# EAGLE design stimulation (EAGLE 7.1.0)
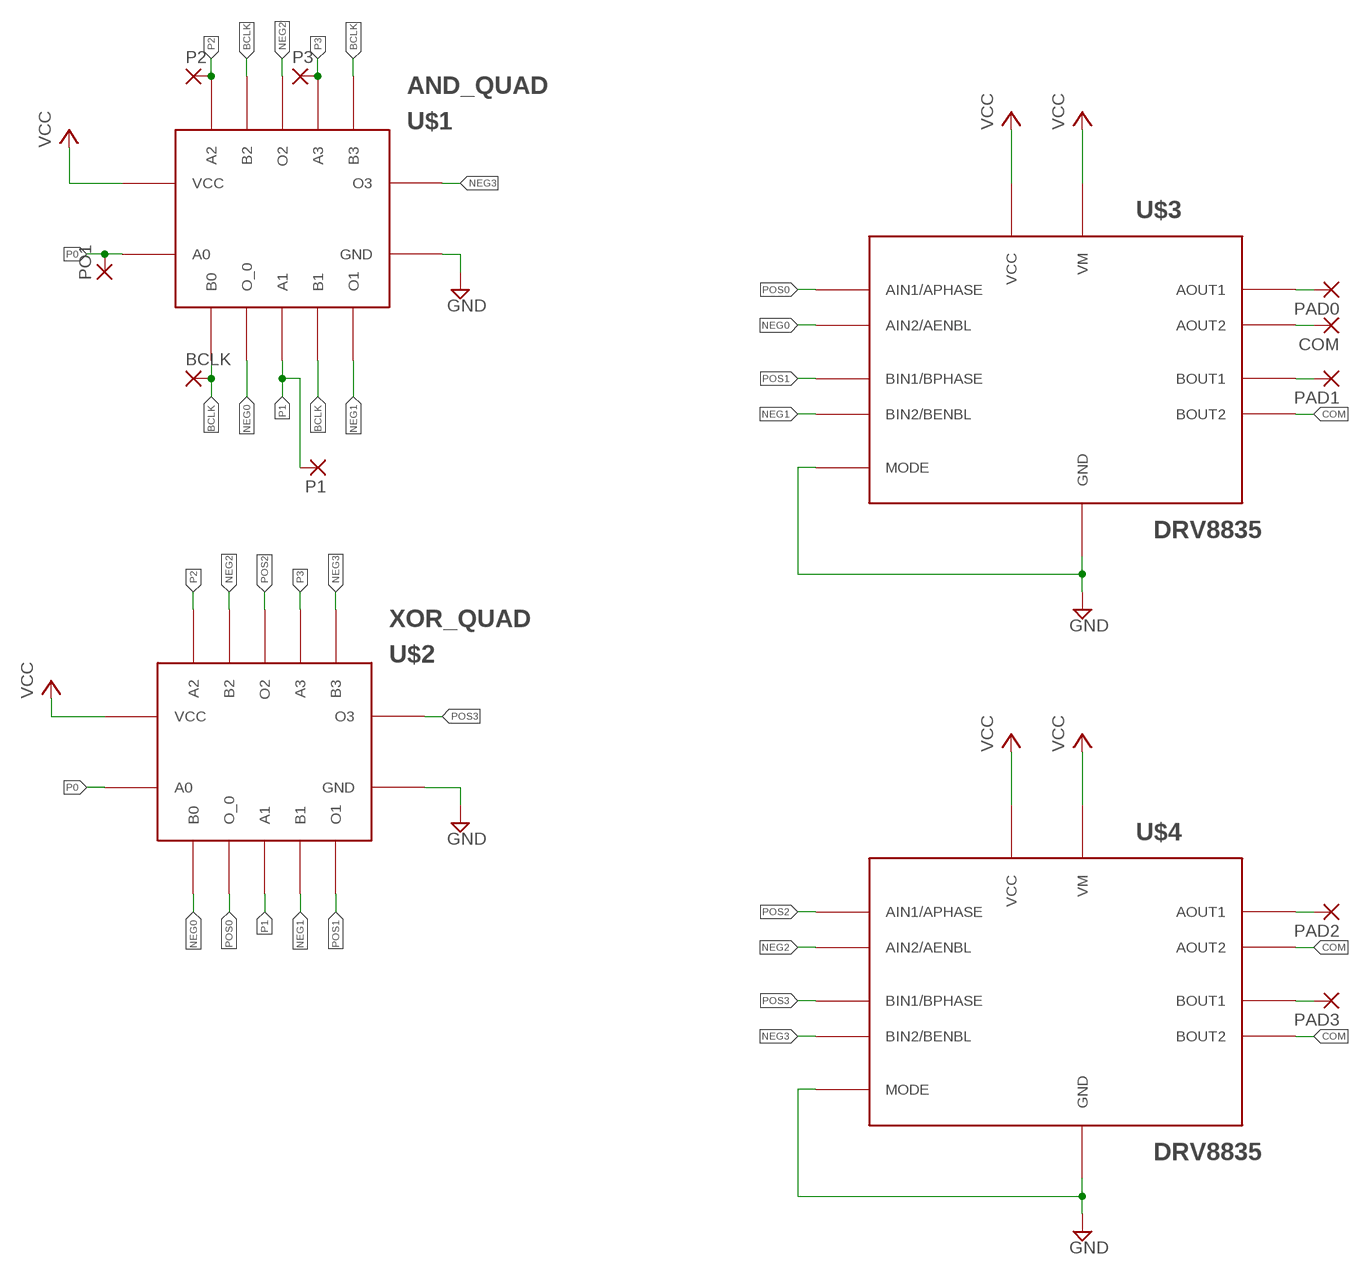
[diagram p0: schematic, sheet 1]

## Parts
BCLK  SMD2  [SMD1,27-2,54]
COM  SMD2  [SMD1,27-2,54]
P1  SMD2  [SMD1,27-2,54]
P2  SMD2  [SMD1,27-2,54]
P3  SMD2  [SMD1,27-2,54]
PAD0  SMD2  [SMD1,27-2,54]
PAD1  SMD2  [SMD1,27-2,54]
PAD2  SMD2  [SMD1,27-2,54]
PAD3  SMD2  [SMD1,27-2,54]
PO1  SMD2  [SMD1,27-2,54]
U$1  AND_QUAD  [QFN-14]
U$2  XOR_QUAD  [QFN-14]
U$3  DRV8835  [QFN-12-HEATSINK]
U$4  DRV8835  [QFN-12-HEATSINK]

## Nets
BCLK: BCLK.1(P) U$1.B0 U$1.B1 U$1.B2 U$1.B3
COM: COM.1(P) U$3.AOUT2 U$3.BOUT2 U$4.AOUT2 U$4.BOUT2
GND: U$1.GND U$2.GND U$3.GND U$3.MODE U$4.GND U$4.MODE
N$5: P1.1(P) U$1.A1
N$6: PAD0.1(P) U$3.AOUT1
N$8: P2.1(P) U$1.A2
N$9: PAD1.1(P) U$3.BOUT1
N$11: P3.1(P) U$1.A3
N$14: PO1.1(P) U$1.A0
N$17: PAD2.1(P) U$4.AOUT1
N$19: PAD3.1(P) U$4.BOUT1
NEG0: U$1.O_0 U$2.B0 U$3.AIN2.AENBL(AIN2/AENBL)
NEG1: U$1.O1 U$2.B1 U$3.BIN2/BENBL
NEG2: U$1.O2 U$2.B2 U$4.AIN2.AENBL(AIN2/AENBL)
NEG3: U$1.O3 U$2.B3 U$4.BIN2/BENBL
P0: U$2.A0
P1: U$2.A1
P2: U$2.A2
P3: U$2.A3
POS0: U$2.O_0 U$3.AIN1/APHASE
POS1: U$2.O1 U$3.BIN1/BPHASE
POS2: U$2.O2 U$4.AIN1/APHASE
POS3: U$2.O3 U$4.BIN1/BPHASE
VCC: U$1.VCC U$2.VCC U$3.VCC U$3.VM U$4.VCC U$4.VM

## Library data of the parts
BCLK COM P1-P3 PAD0 PAD1-PAD3 PO1 = wirepad:SMD2: SMD PAD
U$1 = kushal:AND_QUAD: Quad package SMD AND chip
U$2 = kushal:XOR_QUAD: Quad package SMD XOR
U$3 U$4 = kushal:DRV8835: DRV8835 dual package motor driver H bridge

## Board
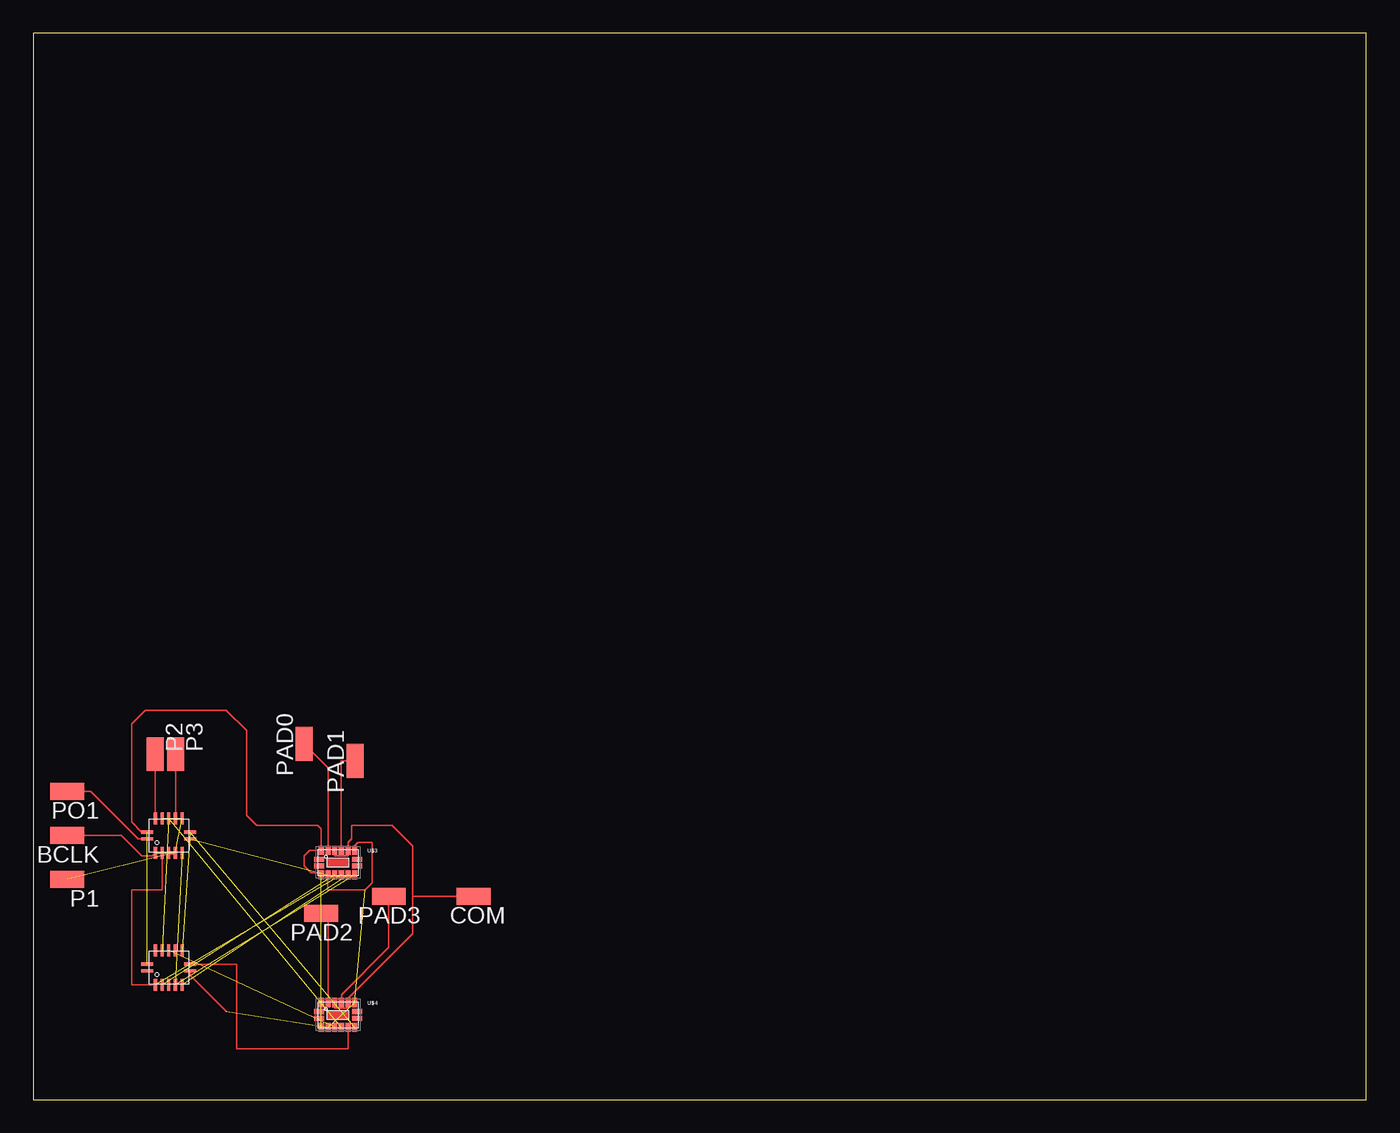
[diagram p1: board, top side]
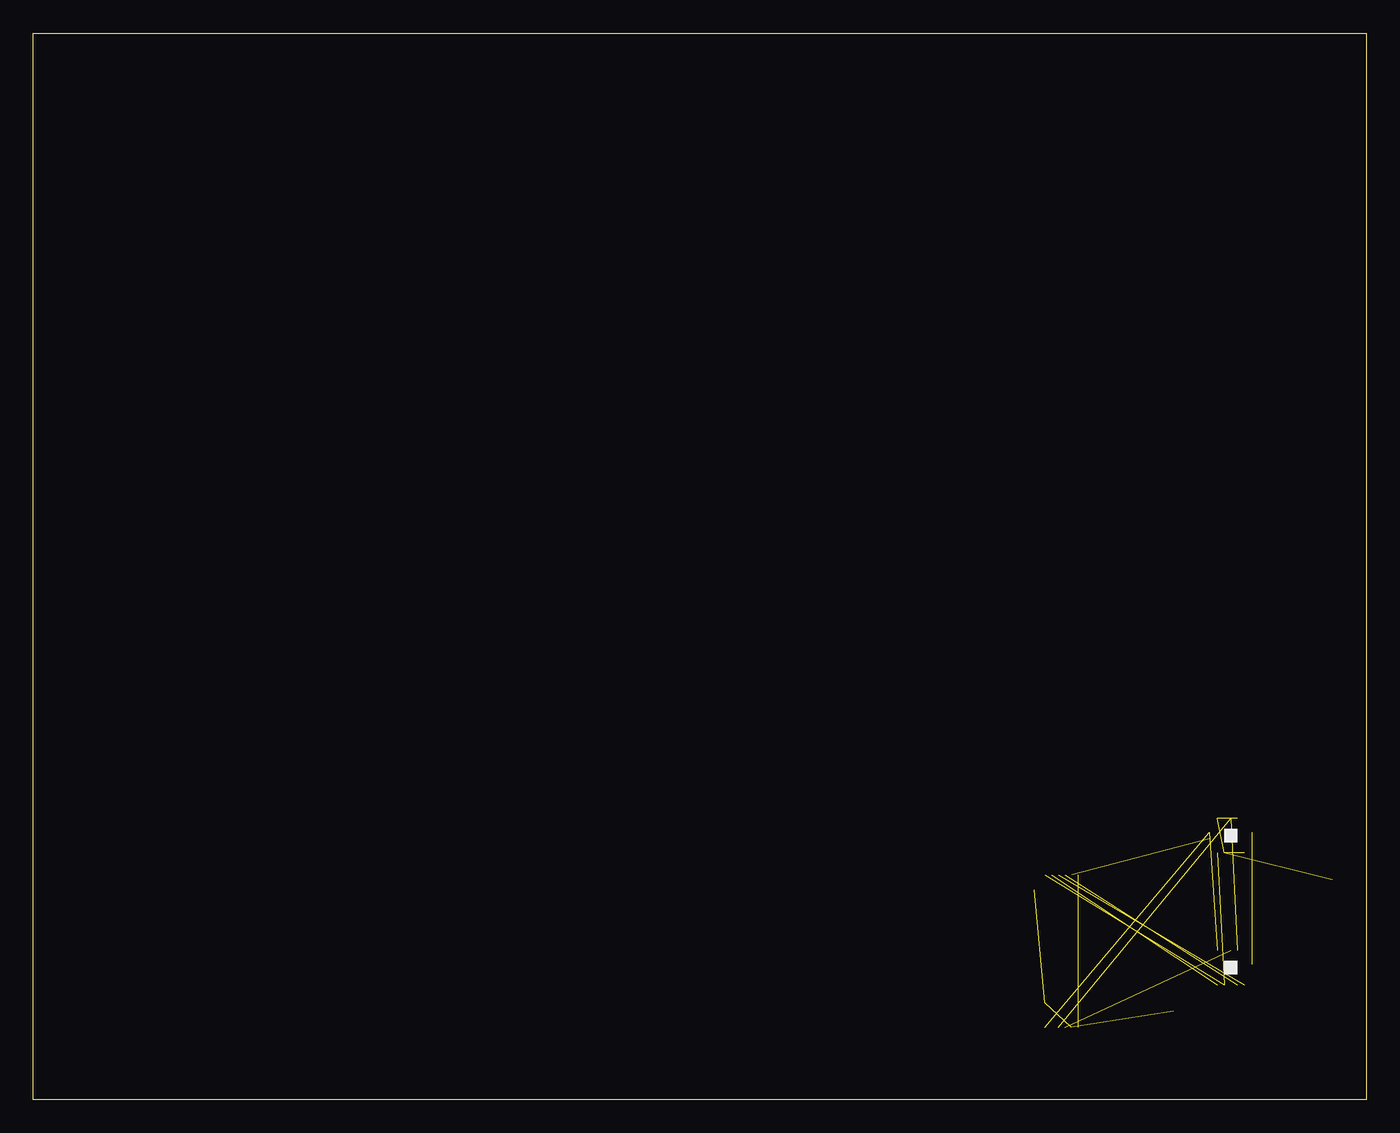
[diagram p2: board, bottom side, seen from below]

Size 100 x 80 mm. Coordinates in mm from the lower left corner, seen from the top.
Outline: 0,0 100,0 100,80 0,80 0,0
Copper layers (1*16): Top 0.035mm / dielectric 1.5mm / Bottom 0.035mm
Design rules "default": minimum track width 10mil, minimum drill 24mil, track to track 8mil, track to pad 8mil, pad to pad 8mil, via to via 8mil, smd to smd 8mil, copper to edge 40mil, drill to drill 8mil, minimum pad ring 10mil, minimum via ring 8mil, stop-mask expansion 4mil, vias tented up to drill 0mil, thermal gap 10mil

### Footprints (pad centres in the part's own frame; a part is rotated, then mirrored left to right if it is on the bottom)
SMD1,27-2,54 = smd 1.27 x 2.54: 1 0,0
QFN-14 = smd 0.9 x 0.24: A0 -1.6,-0.25; GND 1.6,-0.25; O3 1.6,0.25; VCC -1.6,0.25 | smd 0.24 x 0.9: A1 0,-1.3; A2 -1,1.3; A3 0.5,1.3; B0 -1,-1.3; B1 0.5,-1.3; B2 -0.5,1.3; B3 1,1.3; O1 1,-1.3; O2 0,1.3; O_0 -0.5,-1.3; P$11 -1,-1.3
QFN-12-HEATSINK = smd 0.39 x 0.68: AIN1/APHASE -0.25,-0.925; AIN2.AENBL 0.25,-0.925; AOUT1 -0.75,0.925; AOUT2 -0.25,0.925; BIN1/BPHASE 0.75,-0.925; BIN2/BENBL 1.25,-0.925; BOUT1 0.25,0.925; BOUT2 0.75,0.925; GND 1.25,0.925; MODE -0.75,-0.925; VCC -1.25,-0.925; VM -1.25,0.925 | smd 0.74 x 0.39: P$13 -1.425,0.25; P$14 -1.425,-0.25; P$15 1.425,0.25; P$16 1.425,-0.25

### Placement (x,y rotation side)
BCLK  2.54,19.81 90 top
COM  33.02,15.24 90 top
P1  2.54,16.51 90 top
P2  9.14,25.91 180 top
P3  10.67,25.91 180 top
PAD0  20.32,26.67 0 top
PAD1  24.13,25.4 0 top
PAD2  21.59,13.97 90 top
PAD3  26.67,15.24 90 top
PO1  2.54,23.11 90 top
U$1  10.16,19.81 0 top
U$2  10.16,9.91 0 top
U$3  22.86,17.78 0 top
U$4  22.86,6.35 0 top

### Tracks (layer width: path | path; a pad name or v marks a point on that pad's centre or on a via)
BCLK  (3 unrouted)
  Top 0.127: BCLK.1 6.6,19.81 8.13,18.29 8.94,18.29 U$1.B0
COM
  Top 0.127: U$4.AOUT2 22.61,6.86 23.62,6.86 23.62,7.26 U$4.BOUT2 23.61,7.61 28.45,12.45 28.45,15.24 | 28.45,15.24 28.45,19.05 26.92,20.57 23.88,20.57 23.88,19.56 23.62,19.3 23.62,18.72 U$3.BOUT2 23.62,18.69 23.62,18.29 22.61,18.29 U$3.AOUT2 | COM.1 28.45,15.24
GND  (4 unrouted)
  Top 0.127: U$3.GND 24.11,19.03 24.38,19.3 25.4,19.3 25.4,16.26 24.89,15.75 22.1,15.75 22.1,16.84 U$3.MODE | U$2.GND 11.76,9.32 14.48,6.6
N$5  (1 unrouted)
  Top 0.254: U$1.A1 10.67,18.51 10.67,18.54
N$6
  Top 0.127: U$3.AOUT1 22.11,24.88 PAD0.1
N$8
  Top 0.127: P2.1 9.14,21.13 U$1.A2
N$9
  Top 0.127: U$3.BOUT1 23.11,25.4 PAD1.1
N$11
  Top 0.127: P3.1 U$1.A3
N$14
  Top 0.127: PO1.1 4.32,23.11 7.87,19.56 U$1.A0
N$17
  Top 0.127: PAD2.1 22.11,13.97 U$4.AOUT1
N$19
  Top 0.127: PAD3.1 26.67,11.43 23.11,7.87 U$4.BOUT1
NEG0  (1 unrouted)
  Top 0.127: U$2.B0 7.37,8.61 7.37,15.75 9.66,15.75 U$1.O_0
NEG1  (2 unrouted)
NEG2  (2 unrouted)
NEG3  (2 unrouted)
POS0  (1 unrouted)
POS1  (1 unrouted)
POS2  (1 unrouted)
POS3
  Top 0.127: U$4.BIN1/BPHASE 23.62,5.42 23.62,3.81 15.24,3.81 15.24,10.16 U$2.O3
VCC  (3 unrouted)
  Top 0.127: U$1.VCC 8.13,20.06 7.37,20.83 7.37,28.19 8.38,29.21 14.48,29.21 16,27.69 16,21.34 16.76,20.57 21.34,20.57 21.59,20.32 21.59,18.73 U$3.VM 20.74,18.7 20.32,18.29 20.32,17.53 20.83,17.02 21.45,17.02 U$3.VCC